# EAGLE design Capstone (EAGLE 9.6.2)
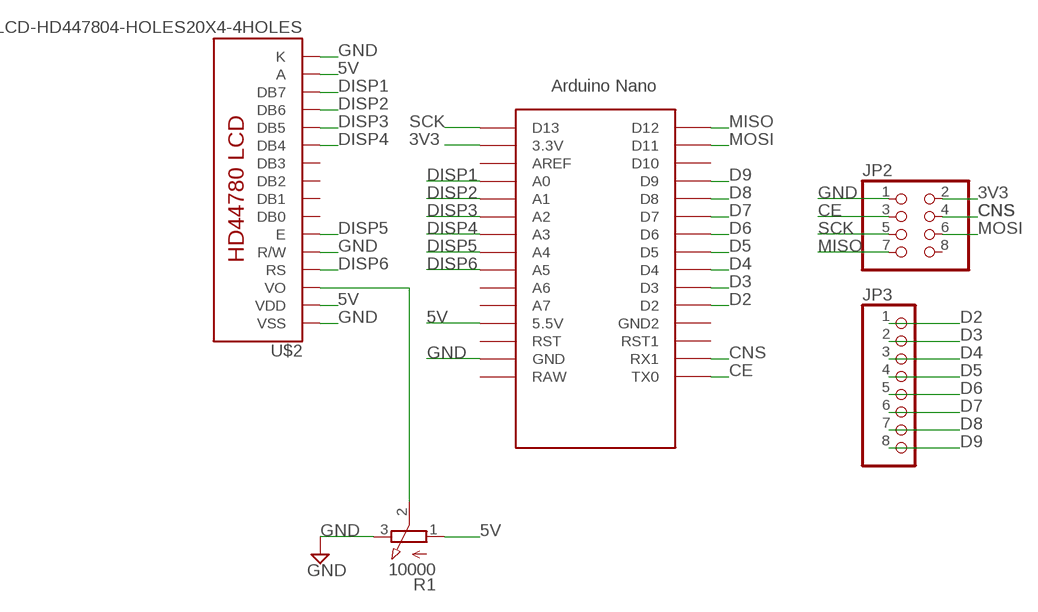
[diagram p0: schematic, sheet 1]

## Parts
JP2  PINHD-2X4  [2X04]
JP3  PINHD-1X8  [1X08]
R1  10000  3RP/1610N  [3RP/1610N]
U$1  NANO  [NANO]
U$2  LCD-HD447804-HOLES20X4-4HOLES  [LCD-20X4-4HOLES]

## Nets
3V3: JP2.2 U$1.3.3V
5V: R1.1(A) U$1.5V(5.5V) U$2.P$2(VDD) U$2.P$15(A)
CE: JP2.3 U$1.TX0
CNS: JP2.4 U$1.RX1
D2: JP3.1 U$1.D2
D3: JP3.2 U$1.D3
D4: JP3.3 U$1.D4
D5: JP3.4 U$1.D5
D6: JP3.5 U$1.D6
D7: JP3.6 U$1.D7
D8: JP3.7 U$1.D8
D9: JP3.8 U$1.D9
DISP1: U$1.A0 U$2.P$14(DB7)
DISP2: U$1.A1 U$2.P$13(DB6)
DISP3: U$1.A2 U$2.P$12(DB5)
DISP4: U$1.A3 U$2.P$11(DB4)
DISP5: U$1.A4 U$2.P$6(E)
DISP6: U$1.A5 U$2.P$4(RS)
DISP8: R1.2(S) U$2.P$3(VO)
GND: JP2.1 R1.3(E) U$1.GND U$2.P$1(VSS) U$2.P$5(R/W) U$2.P$16(K)
MISO: JP2.7 U$1.D12
MOSI: JP2.6 U$1.D11
SCK: JP2.5 U$1.D13
Unconnected: JP2.8 U$1.A6 U$1.A7 U$1.AREF U$1.D10 U$1.GND1(GND2) U$1.ICSP1 U$1.ICSP2 U$1.ICSP3 U$1.ICSP4 U$1.ICSP5 U$1.ICSP6 U$1.RAW U$1.RST U$1.RST1 U$2.P$7(DB0) U$2.P$8(DB1) U$2.P$9(DB2) U$2.P$10(DB3)

## Library data of the parts
JP2 = Capstone_Parts:PINHD-2X4: PIN HEADER
JP3 = pinhead:PINHD-1X8: PIN HEADER
R1 = pot:3RP/1610N: 16mm Potentiometer one level Source: http://www.alphapotentiometers.net/html/16mm_pot_2.html
U$1 = Capstone_Parts:NANO: Arduino Nano
U$2 = Capstone_Parts:LCD-HD44780

## Board
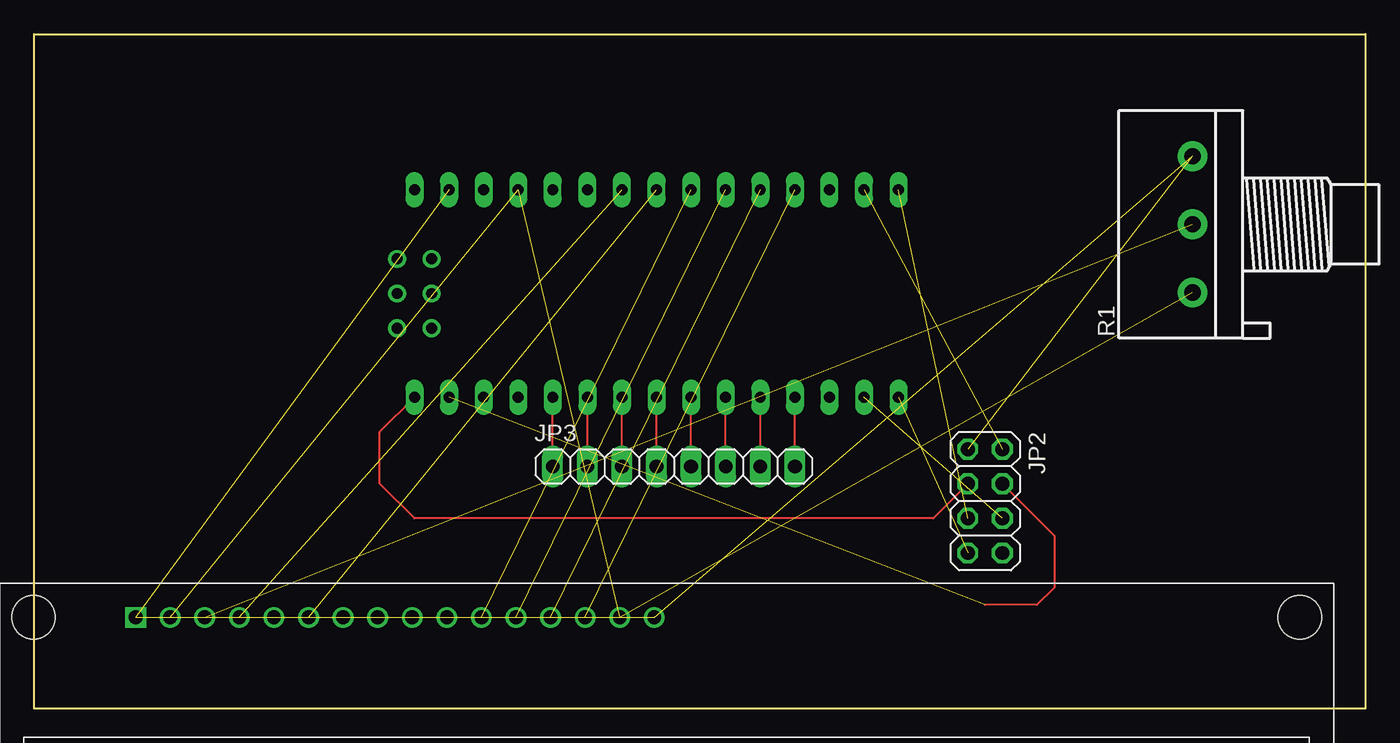
[diagram p1: board, top side]

Size 97.79 x 49.53 mm. Coordinates in mm from the lower left corner, seen from the top.
Outline: 0,0 0,49.53 97.79,49.53 97.79,0 0,0
Copper layers (1*16): Top 0.035mm / dielectric 1.5mm / Bottom 0.035mm
Design rules "default": minimum track width 6mil, minimum drill 0.35mm, track to track 6mil, track to pad 6mil, pad to pad 6mil, via to via 6mil, smd to smd 6mil, copper to edge 40mil, drill to drill 6mil, minimum pad ring 10mil, minimum via ring 8mil, stop-mask expansion 4mil, vias tented up to drill 0mil, thermal gap 10mil

### Footprints (pad centres in the part's own frame; a part is rotated, then mirrored left to right if it is on the bottom)
2X04 = drill 1.016 octagon: 1 -3.81,-1.27; 2 -3.81,1.27; 3 -1.27,-1.27; 4 -1.27,1.27; 5 1.27,-1.27; 6 1.27,1.27; 7 3.81,-1.27; 8 3.81,1.27
1X08 = drill 1.016 long: 1 -8.89,0; 2 -6.35,0; 3 -3.81,0; 4 -1.27,0; 5 1.27,0; 6 3.81,0; 7 6.35,0; 8 8.89,0
3RP/1610N = drill 1.2 pad 2.184: 1 -5,0; 2 0,0; 3 5,0
NANO = drill 0.8 long: 3.3V -10.16,24.13; 5V -10.16,-1.27; A0 -10.16,19.05; A1 -10.16,16.51; A2 -10.16,13.97; A3 -10.16,11.43; A4 -10.16,8.89; A5 -10.16,6.35; A6 -10.16,3.81; A7 -10.16,1.27; AREF -10.16,21.59; D2 5.08,1.27; D3 5.08,3.81; D4 5.08,6.35; D5 5.08,8.89; D6 5.08,11.43; D7 5.08,13.97; D8 5.08,16.51; D9 5.08,19.05; D10 5.08,21.59; D11 5.08,24.13; D12 5.08,26.67; D13 -10.16,26.67; GND -10.16,-6.35; GND1 5.08,-1.27; RAW -10.16,-8.89; RST -10.16,-3.81; RST1 5.08,-3.81; RX1 5.08,-6.35; TX0 5.08,-8.89 | drill 0.8: ICSP1 -5.08,-10.16; ICSP2 -5.08,-7.62; ICSP3 -2.54,-10.16; ICSP4 -2.54,-7.62; ICSP5 0,-10.16; ICSP6 0,-7.62
LCD-20X4-4HOLES = drill 1.016 square: P$1 10,57.5 | drill 1.016: P$2 12.54,57.5; P$3 15.08,57.5; P$4 17.62,57.5; P$5 20.16,57.5; P$6 22.7,57.5; P$7 25.24,57.5; P$8 27.78,57.5; P$9 30.32,57.5; P$10 32.86,57.5; P$11 35.4,57.5; P$12 37.94,57.5; P$13 40.48,57.5; P$14 43.02,57.5; P$15 45.56,57.5; P$16 48.1,57.5 | hole 3.2: 2.5,2.5; 2.5,57.5; 95.5,57.5; 95.5,2.5

### Placement (x,y rotation side)
JP2  69.85,15.24 270 top
JP3  46.99,17.78 0 top
R1  85.09,35.56 90 top
U$1  36.83,27.94 270 top
U$2  -2.54,-50.8 0 top

### Tracks (layer width: path | path; a pad name or v marks a point on that pad's centre or on a via)
3V3  (1 unrouted)
5V  (3 unrouted)
CE
  Top 0.152: JP2.3 66.04,13.97 27.94,13.97 25.4,16.51 25.4,20.32 U$1.TX0
CNS  (1 unrouted)
  Top 0.152: JP2.4 74.93,12.7 74.93,8.89 73.66,7.62 69.85,7.62
D2
  Top 0.152: JP3.1 U$1.D2
D3
  Top 0.152: JP3.2 U$1.D3
D4
  Top 0.152: JP3.3 U$1.D4
D5
  Top 0.152: JP3.4 U$1.D5
D6
  Top 0.152: JP3.5 U$1.D6
D7
  Top 0.152: JP3.6 U$1.D7
D8
  Top 0.152: JP3.7 U$1.D8
D9
  Top 0.152: JP3.8 U$1.D9
DISP1  (1 unrouted)
DISP2  (1 unrouted)
DISP3  (1 unrouted)
DISP4  (1 unrouted)
DISP5  (1 unrouted)
DISP6  (1 unrouted)
DISP8  (1 unrouted)
GND  (5 unrouted)
MISO  (1 unrouted)
MOSI  (1 unrouted)
SCK  (1 unrouted)